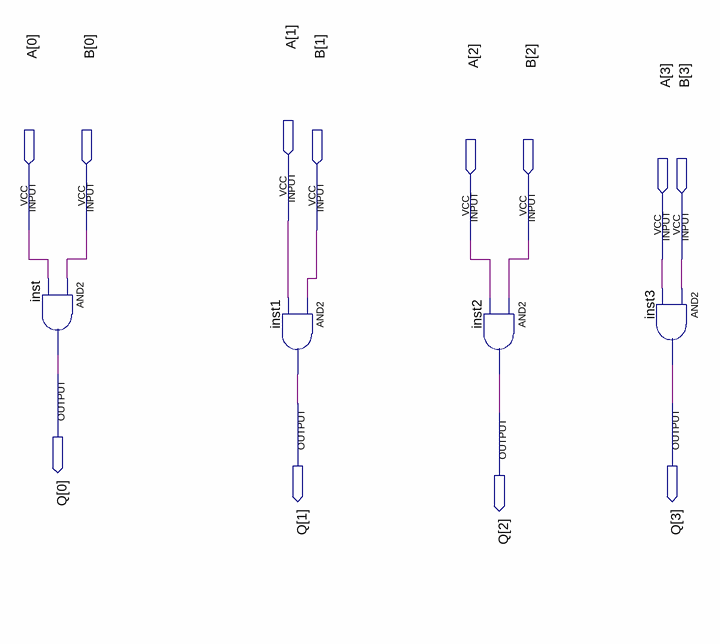
[diagram p0: schematic sheet]
// Quartus schematic AND_4BIT.bdf as structural Verilog: 4 symbols, 12 pins
module AND_4BIT (
  input  [3:0] A,
  input  [3:0] B,
  output [3:0] Q
);

  and inst (Q[0], B[0], A[0]);
  and inst1 (Q[1], B[1], A[1]);
  and inst2 (Q[2], B[2], A[2]);
  and inst3 (Q[3], B[3], A[3]);
endmodule
